# EasyEDA Pro project easyeda项目.epro

# Schematic Schematic1

## Sheets
1 Power: Create Date: 2026-03-11; Page Name: P1; Project Name: HomeNode; Schematic Name: Schematic1; Update Date: 2026-03-11; Company: 嘉立创EDA; Page Size: A4; Version: V1.0
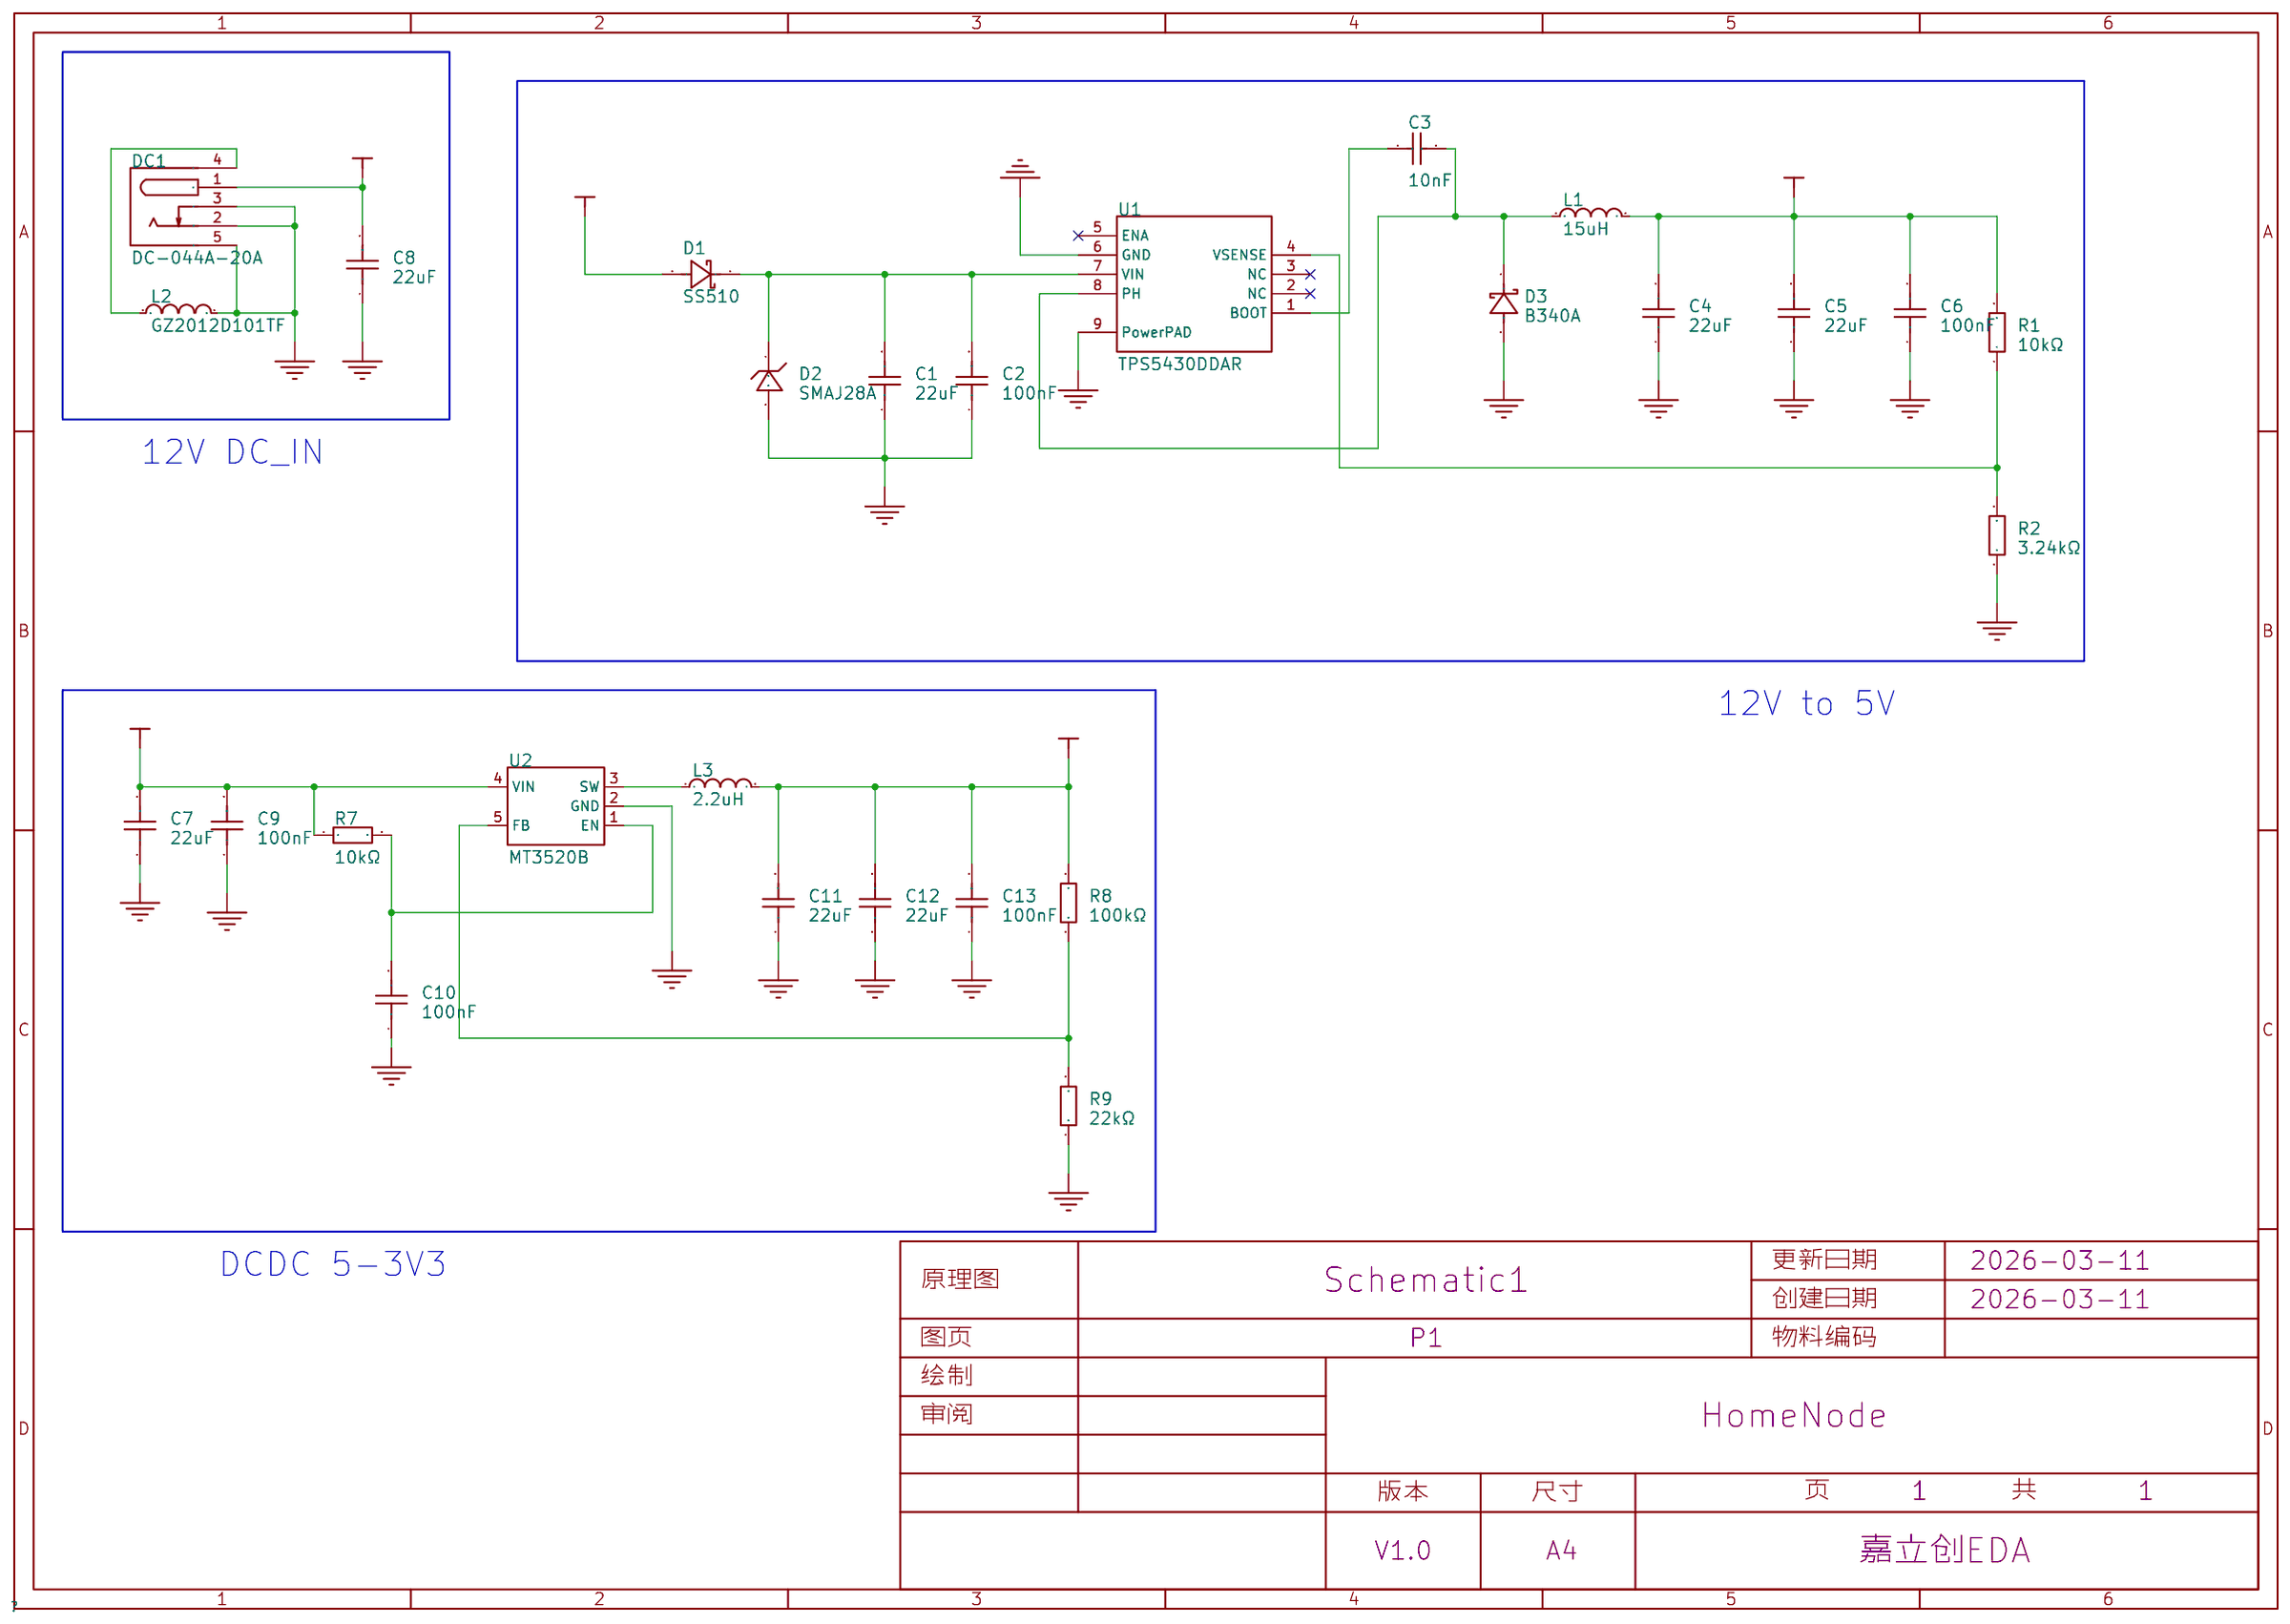
[diagram p0: Power]
2 Peripheral: Page Name: Peripheral
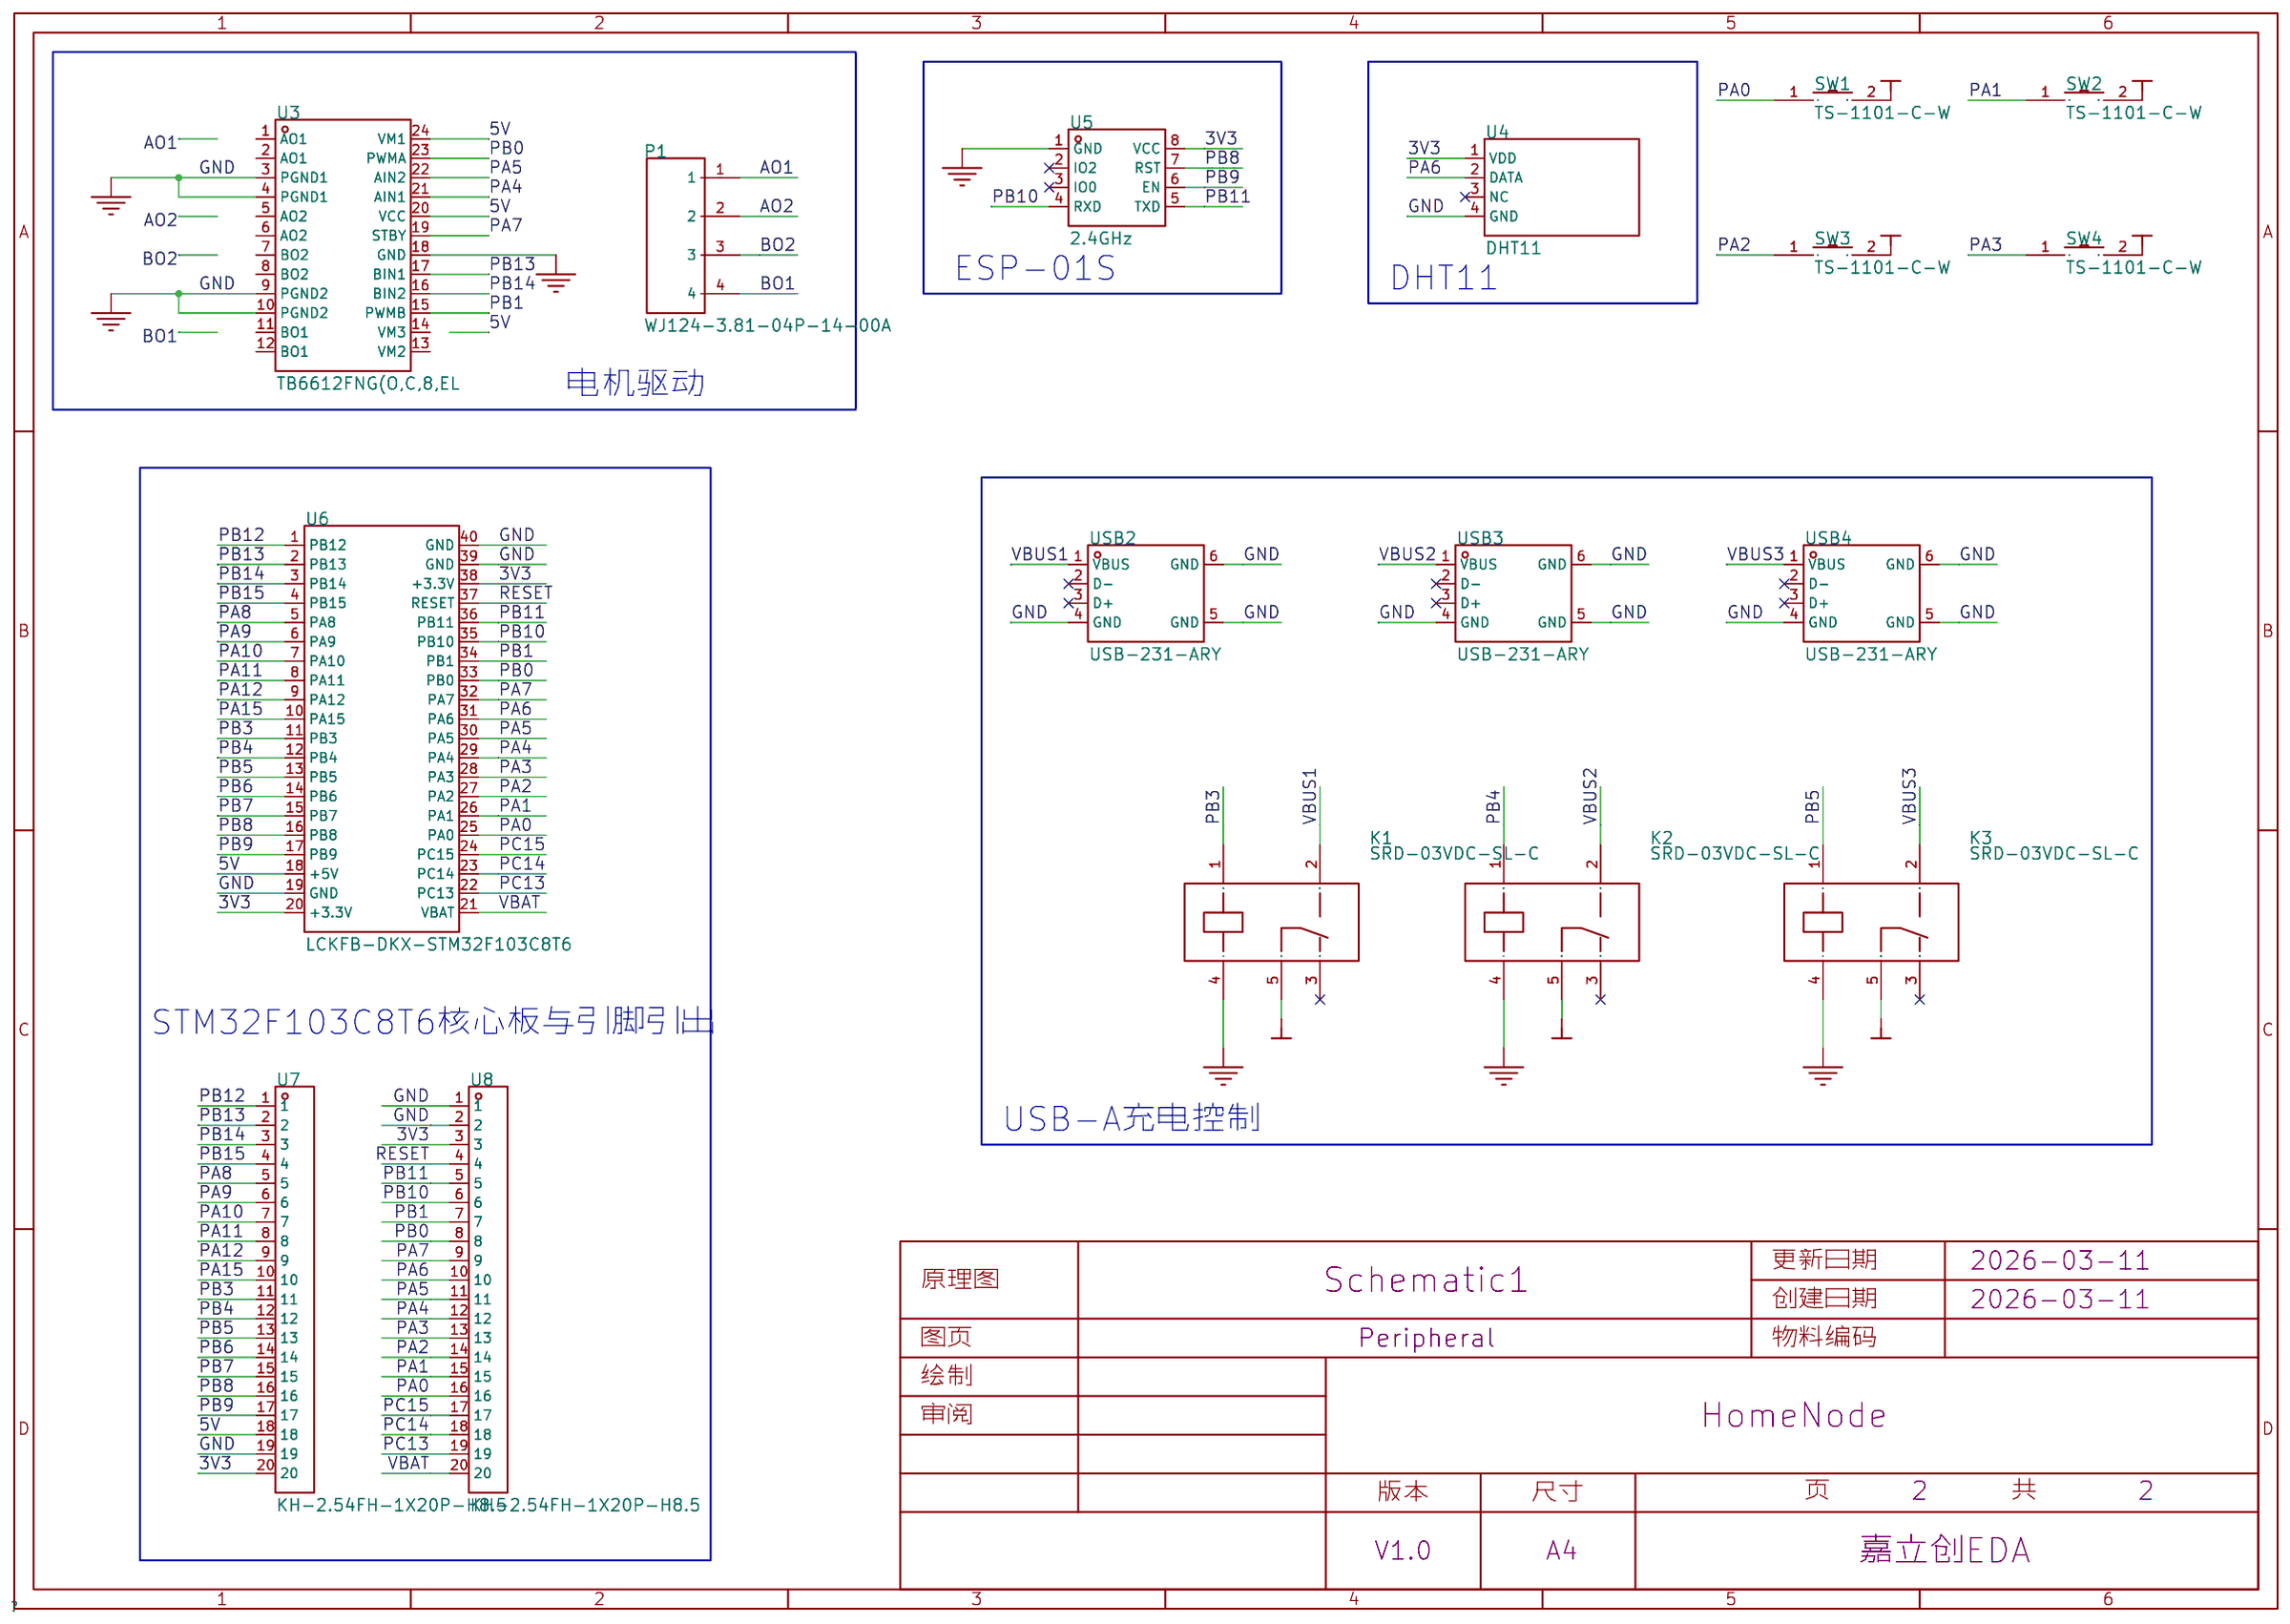
[diagram p1: Peripheral]

## Parts
sheet Peripheral
K1  SRD-03VDC-SL-C  [RELAY-TH_SRD-XXVDC-XL-C]
K2  SRD-03VDC-SL-C  [RELAY-TH_SRD-XXVDC-XL-C]
K3  SRD-03VDC-SL-C  [RELAY-TH_SRD-XXVDC-XL-C]
P1  WJ124-3.81-04P-14-00A  [CONN-TH_4P-P3.81_KF124-3.81-4P]
SW1  TS-1101-C-W  [SW-SMD_L6.0-W3.3-LS8.0]
SW2  TS-1101-C-W  [SW-SMD_L6.0-W3.3-LS8.0]
SW3  TS-1101-C-W  [SW-SMD_L6.0-W3.3-LS8.0]
SW4  TS-1101-C-W  [SW-SMD_L6.0-W3.3-LS8.0]
U3  TB6612FNG(O,C,8,EL  [SSOP-24_L8.4-W5.8-P0.65-LS7.8-BL]
U4  DHT11  [SENSOR-TH_DHT11]
U5  2.4GHz  [WIFIM-TH_8P-L24.7-W14.4-P2.54]
U6  LCKFB-DKX-STM32F103C8T6  [CONN-TH_L53.3-W22.9_STM32F103C8T6-CARD]
U7  KH-2.54FH-1X20P-H8.5  [HDR-TH_20P-P2.54-V-F-2]
U8  KH-2.54FH-1X20P-H8.5  [HDR-TH_20P-P2.54-V-F-2]
USB2  USB-231-ARY  [USB-A-TH_USB-231-ARY]
USB3  USB-231-ARY  [USB-A-TH_USB-231-ARY]
USB4  USB-231-ARY  [USB-A-TH_USB-231-ARY]
sheet Power
C1  22uF  [C0603]
C2  100nF  [C0603]
C3  10nF  [C0603]
C4  22uF  [C0603]
C5  22uF  [C0603]
C6  100nF  [C0603]
C7  22uF  [C0603]
C8  22uF  [C0603]
C9  100nF  [C0603]
C10  100nF  [C0603]
C11  22uF  [C0603]
C12  22uF  [C0603]
C13  100nF  [C0603]
D1  SS510  [SMA_L4.3-W2.6-LS5.0-RD]
D2  SMAJ28A  [SMA_L4.4-W2.8-LS5.4-RD]
D3  B340A  [SMA_L4.3-W2.6-LS5.0-RD]
DC1  DC-044A-20A  [DC-IN-TH_DC-044A-20A]
L1  15uH  [IND-SMD_L7.5-W6.6]
L2  GZ2012D101TF  [L0805]
L3  2.2uH  [IND-SMD_L4.6-W4.1_MHCI04015]
R1  10kΩ  [R0603]
R2  3.24kΩ  [R0603]
R7  10kΩ  [R0603]
R8  100kΩ  [R0603]
R9  22kΩ  [R0603]
U1  TPS5430DDAR  [ESOP-8_L4.9-W3.9-P1.27-LS6.0-TL-EP]
U2  MT3520B  [SOT-23-5_L3.0-W1.7-P0.95-LS2.8-BR]

## Library data of the parts
K1-K3 = SRD-03VDC-SL-C: 线圈电压:3V;触点形式:一组转换:1C(单刀双掷-转换);触点容量(电阻负载):-;最大切换电压:250V@AC;最大切换电流:15A;; LCSC Part Name: 蓝色 单组转换型继电器; Supplier Part: C24585; Manufacturer: 松乐; Supplier Footprint: 插件,19.2x15.6mm; JLCPCB Part Class: Extended Part; Datasheet: https://item.szlcsc.com/datasheet/SRD-03VDC-SL-C/25325.html; Supplier: LCSC; Coil Voltage: 3V; Contact Form: 一组转换:1C(单刀双掷-转换); Number of Pins: 5; Switching Voltage(Max): 250V@AC; Coil Rated Power: 360mW; Switching Current(Max): 15A; Coil Type: 无极性-单线圈; Contact Resistance: 100mΩ; Operate Time: 10ms; Release Time: 10ms
P1 = WJ124-3.81-04P-14-00A: 结构:1x4P;间距:3.81mm;颜色:绿色;安装方式:直插;排数:1;每排PIN数:4;额定电流:15A;额定电压:300V;线规 - AWG:14~30;线规 - 平方毫米:1.5;工作温度:-40℃~+105℃;; LCSC Part Name: 3.81mm 1x4P 排数:1 每排P数:4 直插; Supplier Part: C69809; Manufacturer: KANGNEX(康奈克斯电气); Supplier Footprint: 插件,P=3.81mm; JLCPCB Part Class: Extended Part; Datasheet: https://item.szlcsc.com/datasheet/WJ124-3.81-04P-14-00A/70903.html; Supplier: LCSC; Number of Positions or Pins: 1x4P; Pitch: 3.81mm; Color: 绿色; Mounting Type: 直插; Number of Pins: 4P; Number of Rows: 1; Number of PINs Per Row: 4; Current Rating: 15A; Voltage Rating (Max): 300V; Wire Gauge - AWG: 14~30; Wire Gauge - mm2: 1.5; Operating Temperature: -40℃~+105℃
SW1-SW4 = TS-1101-C-W: 电路结构:单刀单掷;按钮形状:矩形按钮;作用力:260gf;安装方式:立贴;开关长度:6mm;开关宽度:3.6mm;开关高度:2.5mm;带支架:不带;触点电流:50mA;额定电压(AC):-;额定电压(DC):12V;额定功率:-;绝缘电阻:-;带灯:无;机械寿命:5万次;; LCSC Part Name: 6*3.6*2.5mm 立贴 轻触开关; Supplier Part: C318938; Manufacturer: XKB Connectivity(中国星坤); Supplier Footprint: SMD; JLCPCB Part Class: Extended Part; Datasheet: https://atta.szlcsc.com/upload/public/pdf/source/20200227/C318938_C2E53B1EEDE37D980A33616AC086DE53.pdf; Supplier: LCSC; Circuit: 单刀单掷; Actuator Style: 矩形按钮; Operating Force: 260gf; Mounting Style: 立贴; Switch Length: 6mm; Switch Width: 3.6mm; Switch Height: 2.5mm; Strike Gundam: 不带; Contact Current: 50mA; Voltage Rating (DC): 12V; Actuator/Cap Color: 白色带淡绿; With Lamp: 无; Mechanical Life: 5万次; Operating Temperature: -30℃~+85℃
U3 = TB6612FNG(O,C,8,EL: 双直流电机驱动器集成电路; LCSC Part Name: 双直流电机驱动IC; Supplier Part: C88224; Manufacturer: TOSHIBA(东芝); Supplier Footprint: SSOP-24-208mil; JLCPCB Part Class: Extended Part; Datasheet: https://item.szlcsc.com/datasheet/TB6612FNG(O%252CC%252C8%252CEL/89402.html; Supplier: LCSC; Technology: 是; Number of H-bridges: 2; Output Current: 1A; Peak Current: 3.2A; Voltage - Supply: 2.7V~5.5V; RDS(on): 500mΩ; Quiescent Current(Iq): 1uA; Operating Temperature: -20℃~+85℃
U4 = DHT11: 温度范围:-20℃~+60℃;湿度范围:5%RH~95%RH;湿度精度:±5%RH;; LCSC Part Name: 新款电容式数字温湿度传感器,老款已停产16.1x12.6x5.8mm DHT11  电容式传感器; Supplier Part: C117051; Manufacturer: 广州奥松; Supplier Footprint: SIP-4; JLCPCB Part Class: Extended Part; Datasheet: https://item.szlcsc.com/datasheet/DHT11/118309.html; Supplier: LCSC; Temperature Range: -20℃~+60℃; Humidity: 5%RH~95%RH; Voltage - Supply: 3.3V~5.5V; Current - Supply: 1mA; Humidity Tolerance: ±5%RH; Temperature Tolerance: ±2℃
U5 = ESP-01S: 核心处理器:ESP8266芯片;频率:2.4GHz;天线形式:板载PCB天线;发射功率:16dBm;接收灵敏度:-90dBm;; LCSC Part Name: 完整的802.11b/g/nWi-FiSoC模块; Supplier Part: C503582; Manufacturer: Ai-Thinker(安信可); JLCPCB Part Class: Extended Part; Datasheet: https://atta.szlcsc.com/upload/public/pdf/source/20200407/C503582_1139AF8FB42E05635FA0089E1752A536.pdf; Supplier: LCSC; Core Processor: ESP8266芯片; Support Interface: GPIO；UART；PWM; Antenna Type: 板载PCB天线; Output Power: 16dBm; Operating Voltage: 3V~3.6V; Receive  Current: 56mA; Send  Current: 170mA; Sensitivity: -90dBm; Operating Temperature: -20℃~+70℃
U6 = LCKFB-DKX-STM32F103C8T6: 搭载Contex M3内核,程序存储容量64KB,RAM总容量20KB,最高72MHz主频,提供高效的计算能力和稳定的运行环境。; LCSC Part Name: 立创·地阔星-STM32F103C8T6开发板; Supplier Part: C22396880; Manufacturer: 立创开发板; JLCPCB Part Class: Extended Part; Datasheet: https://item.szlcsc.com/datasheet/LCKFB-DKX-STM32F103C8T6/24005615.html; Supplier: LCSC
U7 U8 = KH-2.54FH-1X20P-H8.5: 插孔结构:1x20P;间距:2.54mm;行距:-;圆孔/方孔:方孔;安装方式:直插;排数:单排;总孔位数:20P;额定电流:3A;额定电压:-;插孔方向:顶部;塑高:8.5mm;工作温度:-40℃~+105℃;; LCSC Part Name: 间距:2.54mm 1x20P 直插; Supplier Part: C2905423; Manufacturer: kinghelm(金航标); Supplier Footprint: 插件,P=2.54mm; JLCPCB Part Class: Extended Part; Datasheet: https://item.szlcsc.com/datasheet/KH-2.54FH-1X20P-H8.5/3175197.html; Supplier: LCSC; Holes Structure: 1x20P; Pitch: 2.54mm; Circular Hole / Square Hole: 方孔; Mounting Type: 直插; Number of Rows: 单排; Number of Positions: 20P; Current Rating: 3A; Holes Direction: 顶部; Insulation Height: 8.5mm; Operating Temperature: -40℃~+105℃
USB2-USB4 = USB-231-ARY: 连接器类型:Type-A;协议标准:USB 2.0;公母:母;安装方式:弯插;触点数量:4P;端口数量:1;额定电流 - 电源:1.5A;工作温度:-20℃~+70℃;; LCSC Part Name: Type-A 母 弯插; Supplier Part: C720525; Manufacturer: XUNPU(讯普); Supplier Footprint: 弯插; JLCPCB Part Class: Extended Part; Datasheet: https://item.szlcsc.com/datasheet/USB-231-ARY/763532.html; Supplier: LCSC; Connector Type: Type-A; Protocol Standard: USB 2.0; Gender: 母; Mounting Type: 弯插; Number of Contacts: 4P; Number of Ports: 1; Current Rating-Power: 1.5A; Voltage Rating: 30V; Length: 14.2mm; Detection color: 白色; Operating Temperature: -20℃~+70℃
C1 C4 C5 C7 C8 C11 C12 = CGA0603X5R226M100JT: 容值:22uF;精度:±20%;额定电压:10V;温度系数:X5R;; LCSC Part Name: 22uF ±20% 10V; Supplier Part: C6119863; Manufacturer: HRE(芯声); Supplier Footprint: 0603; JLCPCB Part Class: Extended Part; Datasheet: https://item.szlcsc.com/datasheet/CGA0603X5R226M100JT/7062569.html; Supplier: LCSC; Tolerance: ±20%; Voltage Rating: 10V; Temperature Coefficient: X5R
C2 C6 C9 C10 C13 = CGA0603X7R104K500JT: 容值:100nF;精度:±10%;额定电压:50V;温度系数:X7R;; LCSC Part Name: 100nF ±10% 50V; Supplier Part: C6119867; Manufacturer: HRE(芯声); Supplier Footprint: 0603; JLCPCB Part Class: Extended Part; Datasheet: https://item.szlcsc.com/datasheet/CGA0603X7R104K500JT/7062573.html; Supplier: LCSC; Tolerance: ±10%; Voltage Rating: 50V; Temperature Coefficient: X7R
C3 = CC0603KRX7R9BB103: 容值:10nF;精度:±10%;额定电压:50V;温度系数:X7R;; LCSC Part Name: 10nF ±10% 50V; Supplier Part: C100042; Manufacturer: YAGEO(国巨); Supplier Footprint: 0603; JLCPCB Part Class: Extended Part; Datasheet: https://item.szlcsc.com/datasheet/CC0603KRX7R9BB103/101256.html; Supplier: LCSC; Tolerance: ±10%; Voltage Rating: 50V; Temperature Coefficient: X7R
D1 = SS510_C18199171: 二极管配置:独立式;正向压降(Vf):850mV@5A;直流反向耐压(Vr):100V;整流电流:5A;; LCSC Part Name: 电压:100V 电流:5A; Supplier Part: C18199171; Manufacturer: R+O(宏嘉诚); Supplier Footprint: SMA(DO-214AC); JLCPCB Part Class: Extended Part; Datasheet: https://item.szlcsc.com/datasheet/SS510/19354403.html; Supplier: LCSC; Diode Configuration: 独立式; Voltage - Forward(Vf@If): 850mV@5A; Voltage - DC Reverse(Vr): 100V; Current - Rectified: 5A; Reverse Leakage Current (Ir): 50uA@100V; Operating Junction Temperature Range: -55℃~+150℃; Non-Repetitive Peak Forward Surge Current: 120A
D2 = SMAJ28A_C148227: 极性:单向;反向截止电压(Vrwm):28V;钳位电压:45.4V;峰值脉冲电流(Ipp):8.8A@10/1000us;峰值脉冲功率(Ppp):400W@10/1000us;击穿电压:34.4V;; Supplier Part: C148227; Manufacturer: Littelfuse(美国力特); Supplier Footprint: SMA(DO-214AC); JLCPCB Part Class: Extended Part; Datasheet: https://item.szlcsc.com/datasheet/SMAJ28A/159560.html; Supplier: LCSC; Polarity: 单向; Reverse Stand-Off Voltage (Vrwm): 28V; Clamping Voltage: 45.4V; Peak Pulse Current (Ipp): 8.8A@10/1000us; Peak Pulse Power Dissipation (Ppp): 400W@10/1000us; Voltage - Breakdown: 34.4V; Reverse Leakage Current (Ir): 1uA; Operating Temperature: -65℃~+150℃; level of protection: IEC 61000-4-4；IEC 61000-4-2; Type: TVS
D3 = B340A_C48642440: 二极管配置:1个独立式;正向压降(Vf):550mV@3A;直流反向耐压(Vr):40V;整流电流:3A;; LCSC Part Name: 电压:40V 电流:3A; Supplier Part: C48642440; Manufacturer: R+O(宏嘉诚); Supplier Footprint: SMA; JLCPCB Part Class: Extended Part; Datasheet: https://item.szlcsc.com/datasheet/B340A/50921404.html; Supplier: LCSC; Diode Configuration: 1个独立式; Voltage - Forward(Vf@If): 550mV@3A; Voltage - DC Reverse(Vr): 40V; Current - Rectified: 3A; Reverse Leakage Current (Ir): 50uA@40V; Operating Junction Temperature Range: -55℃~+150℃; Non-Repetitive Peak Forward Surge Current: 100A
DC1 = DC-044A-20A: 连接器类型:DC电源插座;安装方式:弯插;触点内径:2mm;触点外径:5.9mm;额定电流:5A;额定电压:30V;工作温度:-20℃~+70℃;; LCSC Part Name: DC电源插座 内径:2mm 外径:5.9mm; Supplier Part: C129006; Manufacturer: 韩国韩荣; Supplier Footprint: 插件; JLCPCB Part Class: Extended Part; Datasheet: https://item.szlcsc.com/datasheet/DC-044A-20A/140292.html; Supplier: LCSC; Connector Type: DC电源插座; Mounting Type: 弯插; Inside Contact Diameter: 2mm; Outside Contact Diameter: 5.9mm; Current Rating: 5A; Voltage Rating (Max): 30V; Operating Temperature: -20℃~+70℃
L1 = PCR0650-150-M: 电感值:15uH;精度:±20%;额定电流:4A;饱和电流(Isat):5A;类型:一体成型电感;; LCSC Part Name: 15μH ±20% 5A; Supplier Part: C53896883; Manufacturer: JIERR(捷而瑞); Supplier Footprint: SMD,7.5x6.6mm; JLCPCB Part Class: Extended Part; Datasheet: https://item.szlcsc.com/datasheet/PCR0650-150-M/57092565.html; Supplier: LCSC; Tolerance: ±20%; Current Rating: 4A; Current - Saturation(Isat): 5A; DC Resistance(DCR): 90mΩ; Type: 一体成型电感
L2 = GZ2012D101TF: 阻抗@频率:100Ω@100MHz;误差:±25%;直流电阻(DCR):150mΩ;; LCSC Part Name: 单路 0805磁珠 阻抗100Ω@100MHz; Supplier Part: C1015; Manufacturer: Sunlord(顺络); Supplier Footprint: 0805; JLCPCB Part Class: Basic Part; Datasheet: https://item.szlcsc.com/datasheet/GZ2012D101TF/1367.html; Supplier: LCSC; Impedance @ Frequency: 100Ω@100MHz; Tolerance: ±25%; DC Resistance(DCR): 150mΩ; Current Rating: 800mA; Number of Circuits: 1; Operating Temperature: -55℃~+125℃
L3 = SRG0420-2R2-M: 电感值:2.2uH;精度:±20%;额定电流:4A;饱和电流(Isat):5A;类型:一体成型电感;; LCSC Part Name: 2.2μH ±20% 5A; Supplier Part: C53462916; Manufacturer: JIERR(捷而瑞); Supplier Footprint: SMD,4.6x4.1mm; JLCPCB Part Class: Extended Part; Datasheet: https://item.szlcsc.com/datasheet/SRG0420-2R2-M/56628161.html; Supplier: LCSC; Tolerance: ±20%; Current Rating: 4A; Current - Saturation(Isat): 5A; DC Resistance(DCR): 49mΩ; Type: 一体成型电感
R1 R7 = 0603WAF1002T5E: 电阻类型:厚膜电阻;阻值:10kΩ;精度:±1%;功率:100mW;工作电压:75V;温度系数:±100ppm/℃;; LCSC Part Name: 厚膜电阻 10kΩ ±1% 100mW; Supplier Part: C25804; Manufacturer: UNI-ROYAL(厚声); Supplier Footprint: 0603; JLCPCB Part Class: Basic Part; Datasheet: https://item.szlcsc.com/datasheet/0603WAF1002T5E/26547.html; Supplier: LCSC; Type: 厚膜电阻; Tolerance: ±1%; Power(Watts): 100mW; Voltage-Supply(Max): 75V; Temperature Coefficient: ±100ppm/℃; Operating Temperature: -55℃~+155℃
R2 = RMC06033.24K1%N: 电阻类型:厚膜电阻;阻值:3.24kΩ;精度:±1%;功率:100mW;工作电压:50V;温度系数:±100ppm/℃;; LCSC Part Name: 3.24kΩ ±1% 100mW; Supplier Part: C269709; Manufacturer: Tyohm(幸亚电阻); Supplier Footprint: 0603; JLCPCB Part Class: Extended Part; Datasheet: https://item.szlcsc.com/datasheet/RMC06033.24K1%2525N/259149.html; Supplier: LCSC; Type: 厚膜电阻; Tolerance: ±1%; Power(Watts): 100mW; Voltage-Supply(Max): 50V; Temperature Coefficient: ±100ppm/℃; Operating Temperature: -55℃~+155℃
R8 = 0603WAF1003T5E: 电阻类型:厚膜电阻;阻值:100kΩ;精度:±1%;功率:100mW;工作电压:75V;温度系数:±100ppm/℃;; LCSC Part Name: 100kΩ ±1% 100mW 厚膜电阻; Supplier Part: C25803; Manufacturer: UNI-ROYAL(厚声); Supplier Footprint: 0603; JLCPCB Part Class: Basic Part; Datasheet: https://item.szlcsc.com/datasheet/0603WAF1003T5E/26546.html; Supplier: LCSC; Type: 厚膜电阻; Tolerance: ±1%; Power(Watts): 100mW; Temperature Coefficient: ±100ppm/℃; Overload Voltage (Max): 75V; Operating Temperature Range: -55℃~+155℃; Voltage-Supply(Max): 75V; Operating Temperature: -55℃~+155℃
R9 = 0603WAF2202T5E: 电阻类型:厚膜电阻;阻值:22kΩ;精度:±1%;功率:100mW;工作电压:75V;温度系数:±100ppm/℃;; LCSC Part Name: 22kΩ ±1% 100mW 厚膜电阻; Supplier Part: C31850; Manufacturer: UNI-ROYAL(厚声); Supplier Footprint: 0603; JLCPCB Part Class: Basic Part; Datasheet: https://item.szlcsc.com/datasheet/0603WAF2202T5E/32812.html; Supplier: LCSC; Type: 厚膜电阻; Tolerance: ±1%; Power(Watts): 100mW; Voltage-Supply(Max): 75V; Temperature Coefficient: ±100ppm/℃; Operating Temperature: -55℃~+155℃
U1 = TPS5430DDAR: 功能类型:降压型;工作电压:5.5V~36V;输出电压:1.221V~32.04V;输出电流:3A;输出类型:可调;; LCSC Part Name: 降压型 3A 5.5V~36V; Supplier Part: C9864; Manufacturer: TI(德州仪器); Supplier Footprint: SOIC-8-EP; JLCPCB Part Class: Basic Part; Datasheet: https://www.ti.com/lit/ds/symlink/tps5430.pdf; Supplier: LCSC; Function: 降压型; Voltage - Supply: 5.5V~36V; Output Voltage: 1.221V~32.04V; Output Current: 3A; Frequency - Switching: 500kHz; Operating Temperature: -40℃~+125℃@(TJ); Synchronous Rectifier: 否; Number of Outputs: 1; Topology: 降压式; Quiescent Current: 4.4mA; Switch tube (built-in/external): 内置; Output Type: 可调
U2 = MT3520B: 功能类型:降压型;工作电压:2.3V~6V;输出电流:2A;输出类型:可调;; LCSC Part Name: 停产 降压型 2A 2.3V~6V; Supplier Part: C2684933; Manufacturer: 西安航天民芯; Supplier Footprint: SOT-23-5; JLCPCB Part Class: Extended Part; Datasheet: https://item.szlcsc.com/datasheet/MT3520B/2783998.html; Supplier: LCSC; Function: 降压型; Voltage - Supply: 2.3V~6V; Output Current: 2A; Frequency - Switching: 1.5MHz; Operating Temperature: -40℃~+85℃; Synchronous Rectifier: 是; Number of Outputs: 1; Topology: 降压式; Quiescent Current: 40uA; Switch tube (built-in/external): 内置; Output Type: 可调

## Nets
3V3: C11.2 C12.2 C13.2 L3.2 R8.2 SW1.2 SW2.2 SW3.2 SW4.2 U4.1(VDD) U5.8(VCC) U6.20(+3.3V) U6.38(+3.3V) U7.20 U8.3
5V: C4.2 C5.2 C6.2 C7.2 C9.2 K1.5 K2.5 K3.5 L1.2 R1.2 R7.1 U2.4(VIN) U3.13(VM2) U3.14(VM3) U3.20(VCC) U3.24(VM1) U6.18(+5V) U7.18
12V: C8.2 D1.2(A) DC1.1
GND: C1.1 C2.1 C4.1 C5.1 C6.1 C7.1 C8.1 C9.1 C10.1 C11.1 C12.1 C13.1 D2.2 D3.2(A) DC1.2 DC1.3 DC1.5 K1.4 K2.4 K3.4 L2.2 R2.1 R9.1 U1.6(GND) U1.9(PowerPAD) U2.2(GND) U3.3(PGND1) U3.4(PGND1) U3.9(PGND2) U3.10(PGND2) U3.18(GND) U4.4(GND) U5.1(GND) U6.19(GND) U6.39(GND) U6.40(GND) U7.19 U8.1 U8.2 USB2.4(GND) USB2.5(GND) USB2.6(GND) USB3.4(GND) USB3.5(GND) USB3.6(GND) USB4.4(GND) USB4.5(GND) USB4.6(GND)
VBAT: U6.21(VBAT) U8.20
VBUS1: K1.2 USB2.1(VBUS)
VBUS2: K2.2 USB3.1(VBUS)
VBUS3: K3.2 USB4.1(VBUS)
AO1: P1.1 U3.1(AO1) U3.2(AO1)
AO2: P1.2 U3.5(AO2) U3.6(AO2)
BO1: P1.4 U3.11(BO1) U3.12(BO1)
BO2: P1.3 U3.7(BO2) U3.8(BO2)
PA0: SW1.1 U6.25(PA0) U8.16
PA1: SW2.1 U6.26(PA1) U8.15
PA2: SW3.1 U6.27(PA2) U8.14
PA3: SW4.1 U6.28(PA3) U8.13
PA4: U3.21(AIN1) U6.29(PA4) U8.12
PA5: U3.22(AIN2) U6.30(PA5) U8.11
PA6: U4.2(DATA) U6.31(PA6) U8.10
PA7: U3.19(STBY) U6.32(PA7) U8.9
PA8: U6.5(PA8) U7.5
PA9: U6.6(PA9) U7.6
PA10: U6.7(PA10) U7.7
PA11: U6.8(PA11) U7.8
PA12: U6.9(PA12) U7.9
PA15: U6.10(PA15) U7.10
PB0: U3.23(PWMA) U6.33(PB0) U8.8
PB1: U3.15(PWMB) U6.34(PB1) U8.7
PB3: K1.1 U6.11(PB3) U7.11
PB4: K2.1 U6.12(PB4) U7.12
PB5: K3.1 U6.13(PB5) U7.13
PB6: U6.14(PB6) U7.14
PB7: U6.15(PB7) U7.15
PB8: U5.7(RST) U6.16(PB8) U7.16
PB9: U5.6(EN) U6.17(PB9) U7.17
PB10: U5.4(RXD) U6.35(PB10) U8.6
PB11: U5.5(TXD) U6.36(PB11) U8.5
PB12: U6.1(PB12) U7.1
PB13: U3.17(BIN1) U6.2(PB13) U7.2
PB14: U3.16(BIN2) U6.3(PB14) U7.3
PB15: U6.4(PB15) U7.4
PC13: U6.22(PC13) U8.19
PC14: U6.23(PC14) U8.18
PC15: U6.24(PC15) U8.17
RESET: U6.37(RESET) U8.4
$1N32: DC1.4 L2.1
$1N65: C10.2 R7.2 U2.1(EN)
$1N68: L3.1 U2.3(SW)
$1N73: R8.1 R9.2 U2.5(FB)
$1N77: C1.2 C2.2 D1.1(K) D2.1 U1.7(VIN)
$1N81: C3.1 D3.1(K) L1.1 U1.8(PH)
$1N82: C3.2 U1.1(BOOT)
$1N88: R1.1 R2.2 U1.4(VSENSE)

Not connected (* = marked no-connect by the designer): K1 3*; K2 3*; K3 3*; U1 2(NC)* 3(NC)* 5(ENA)*; U4 3(NC)*; U5 2(IO2)* 3(IO0)*; USB2 2(D-)* 3(D+)*; USB3 2(D-)* 3(D+)*; USB4 2(D-)* 3(D+)*

## Notes on the sheets
sheet 1
- 12V DC_IN
- 12V to 5V
- DCDC 5-3V3
sheet 2
- ESP-01S
- DHT11
- 电机驱动
- STM32F103C8T6核心板与引脚引出
- USB-A充电控制

# Board NodePCB
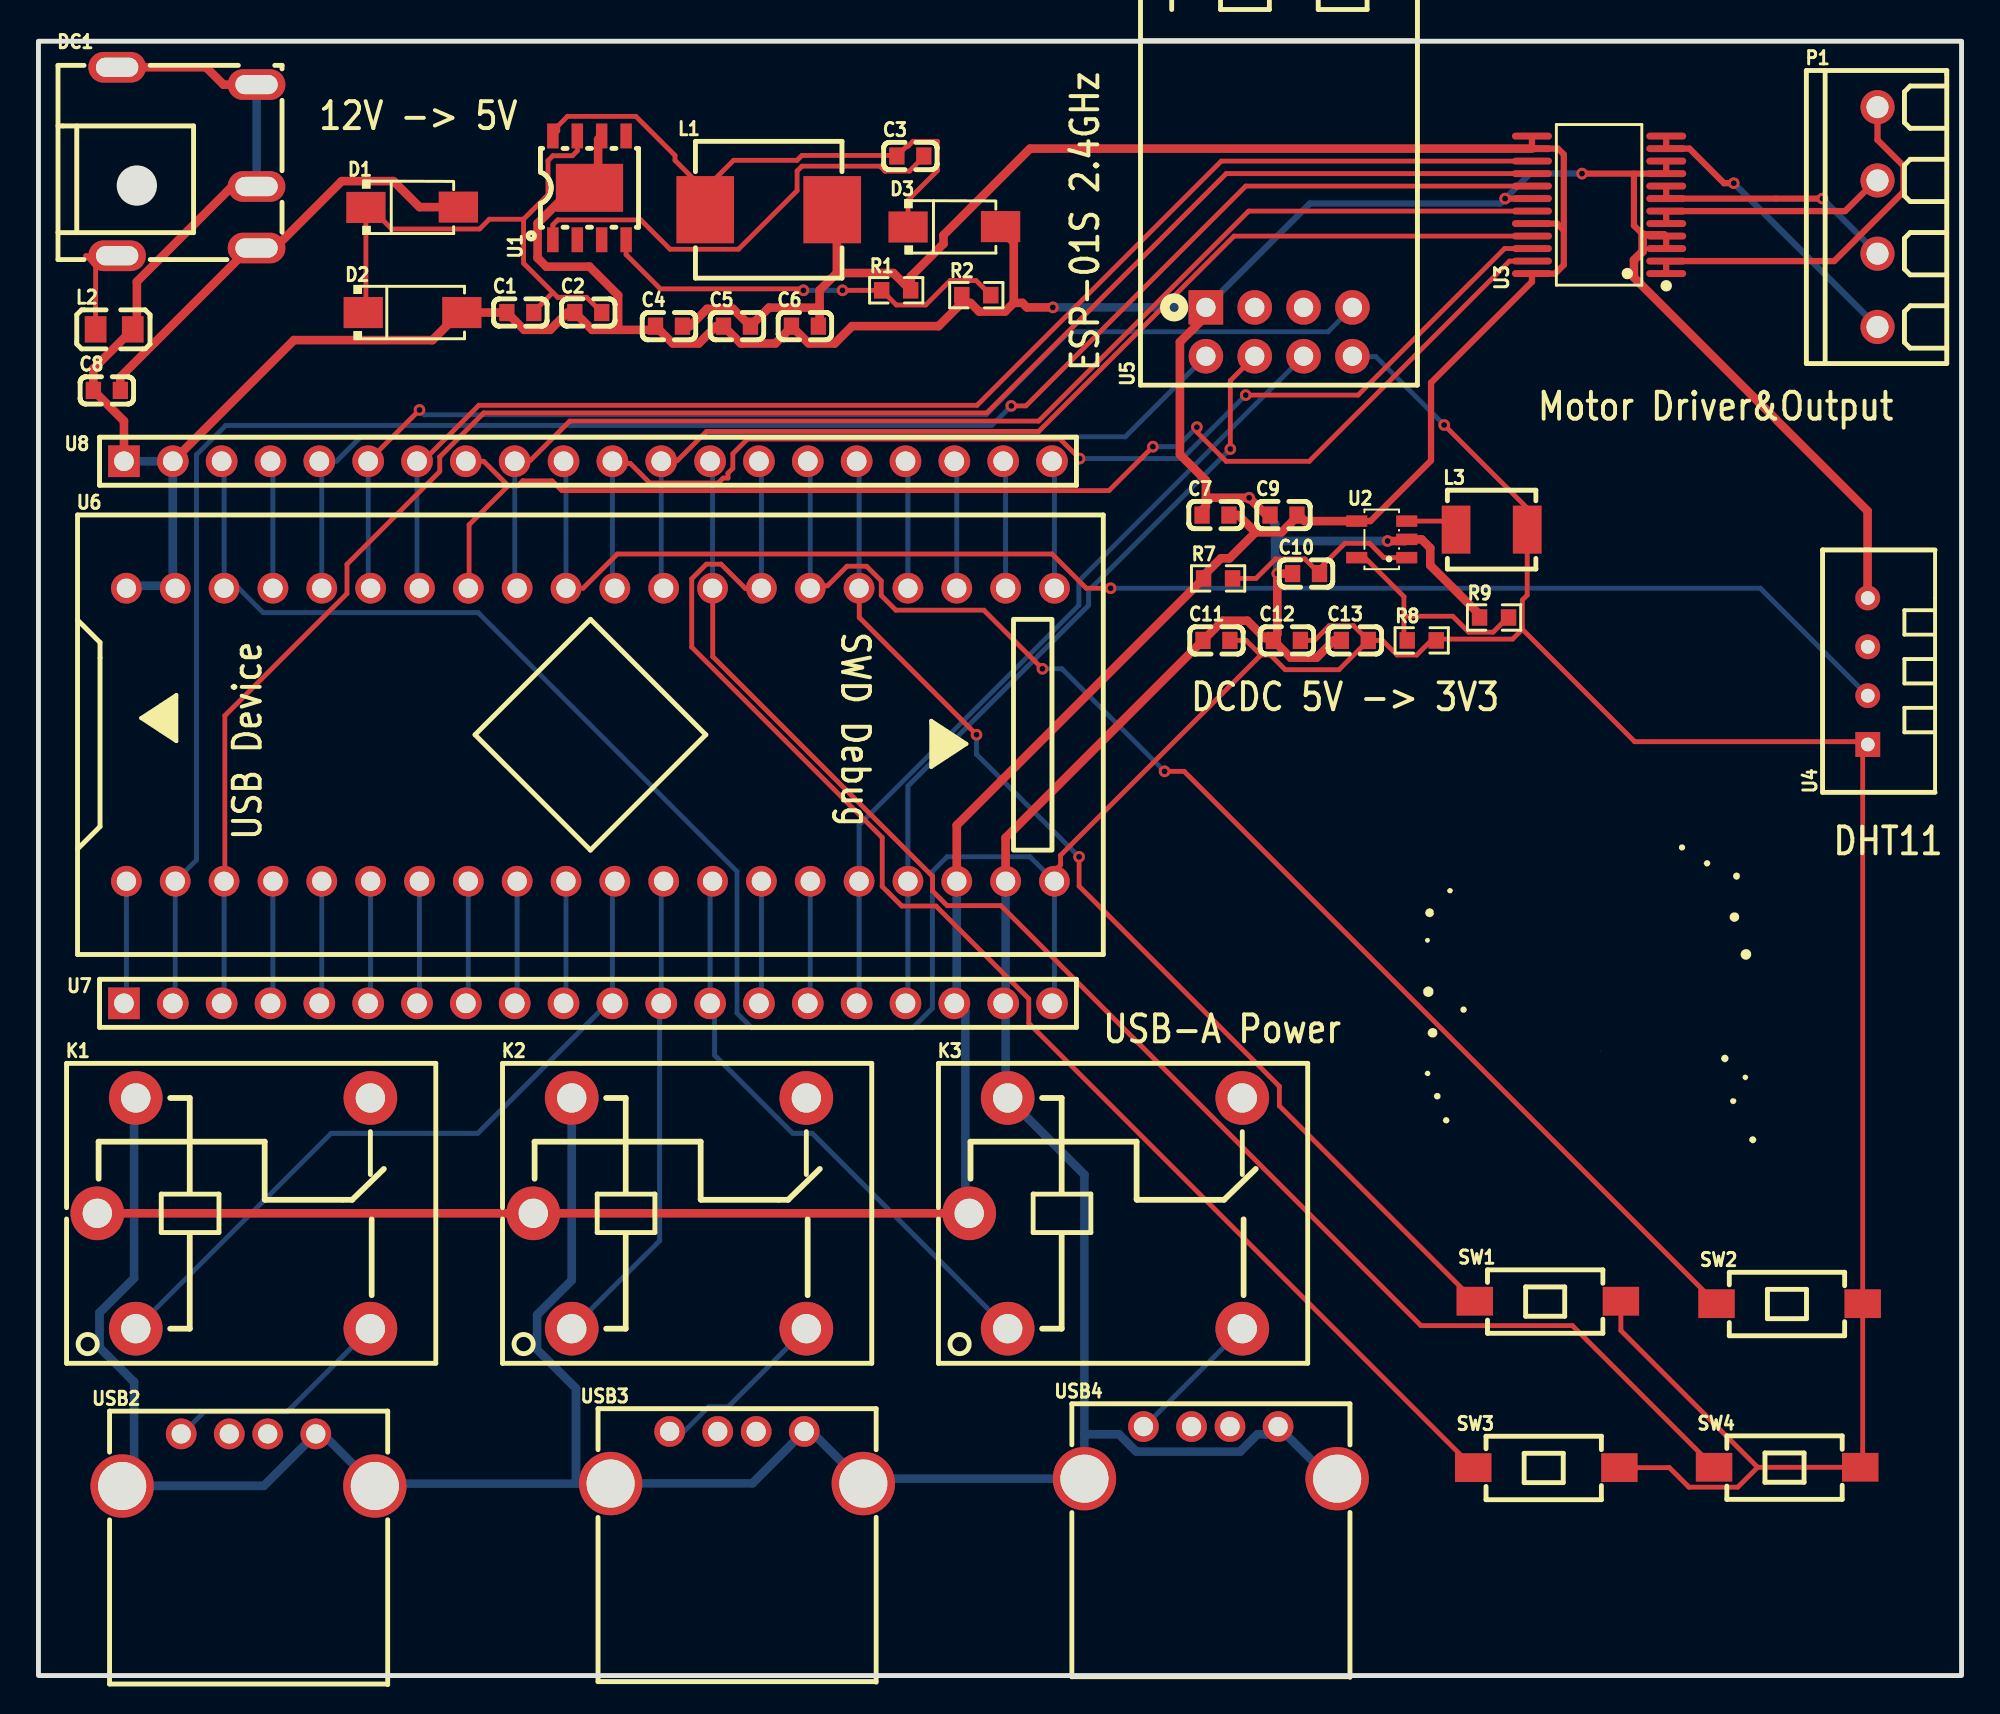
[diagram p2: board, top side]
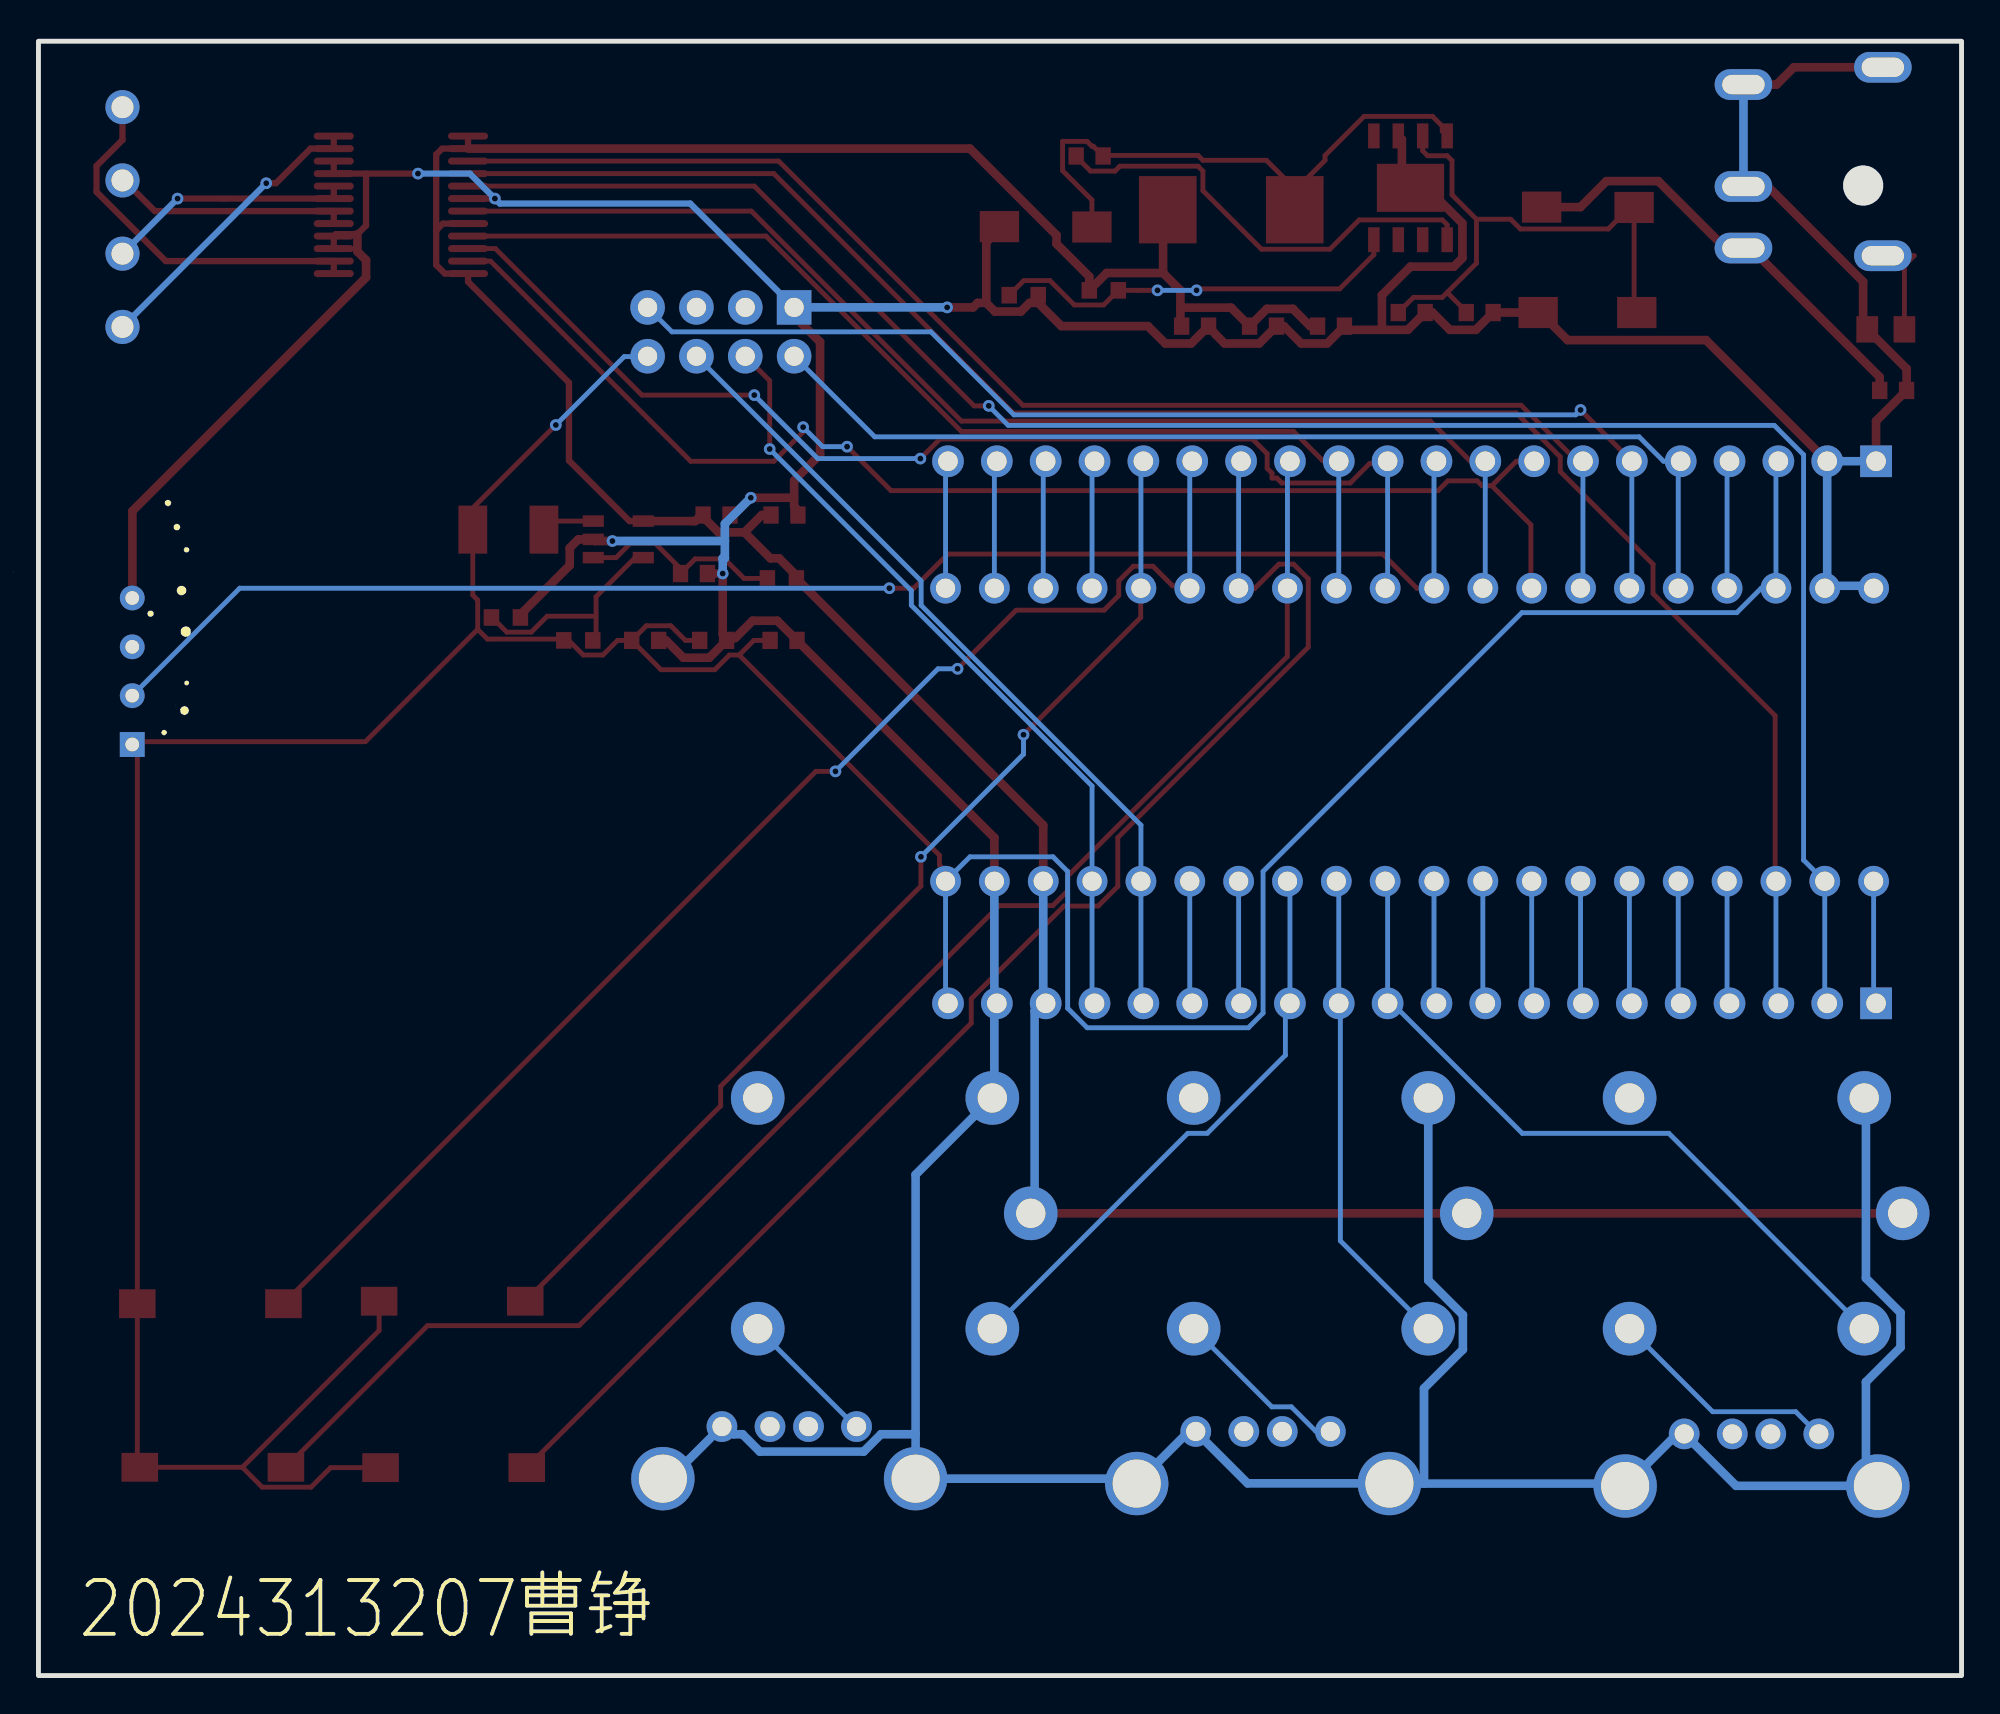
[diagram p3: board, bottom side, seen from below]

Outline 100 x 85 mm; copper layers: Top Layer, Bottom Layer. Coordinates in mm from the lower left corner of the outline.
Outline path: rectangle 0,85 100,0
Stack: Top Layer 0.035mm / Dielectric1 1.51mm FR4 er 4.5 / Bottom Layer 0.035mm

## Design rules (mm)
spacing copperThickness1oz (default): track to track 0.102, other pairs 0.152 to 0.3
spacing copperThickness2oz: track to track 0.203, other pairs 0.152 to 0.3
track width copperThickness1oz (default): min 0.127, default 0.254, max 2.54
track width copperThickness2oz: min 0.203, default 0.254, max 2.54
track width power: min 0.254, default 0.45, max 2.54
differential pair differentialPair (default): width min 0.127, default 0.254, max 2.54; gap min 0.152, default 0.152
net 12V uses copperThickness2oz, power
net GND uses copperThickness2oz, power
net 5V uses copperThickness2oz, power
net VBAT uses copperThickness2oz
net AO1 uses power
net AO2 uses power
net BO1 uses power
net BO2 uses power

## Placement (name value [footprint] x y rotation side)
C1  22uF  [C0603]  25.06 70.89 0 top
C2  100nF  [C0603]  28.59 70.89 0 top
C3  10nF  [C0603]  45.34 79.03 0 top
C4  22uF  [C0603]  32.79 70.18 0 top
C5  22uF  [C0603]  36.32 70.18 0 top
C6  100nF  [C0603]  39.86 70.18 0 top
C7  22uF  [C0603]  61.21 60.36 0 top
C8  22uF  [C0603]  3.56 66.84 0 top
C9  100nF  [C0603]  64.74 60.36 0 top
C10  100nF  [C0603]  65.91 57.31 0 top
C11  22uF  [C0603]  61.25 53.84 0 top
C12  22uF  [C0603]  64.92 53.84 0 top
C13  100nF  [C0603]  68.45 53.84 0 top
D1  SS510  [SMA_L4.3-W2.6-LS5.0-RD]  19.43 76.36 0 top
D2  SMAJ28A  [SMA_L4.4-W2.8-LS5.4-RD]  19.45 70.89 0 top
D3  B340A  [SMA_L4.3-W2.6-LS5.0-RD]  47.62 75.35 0 top
DC1  DC-044A-20A  [DC-IN-TH_DC-044A-20A]  7.72 78.75 0 top
K1  SRD-03VDC-SL-C  [RELAY-TH_SRD-XXVDC-XL-C]  10.16 24.04 0 top
K2  SRD-03VDC-SL-C  [RELAY-TH_SRD-XXVDC-XL-C]  32.83 24.04 0 top
K3  SRD-03VDC-SL-C  [RELAY-TH_SRD-XXVDC-XL-C]  55.5 24.04 0 top
L1  15uH  [IND-SMD_L7.5-W6.6]  37.97 76.24 0 top
L2  GZ2012D101TF  [L0805]  3.94 70.01 0 top
L3  2.2uH  [IND-SMD_L4.6-W4.1_MHCI04015]  75.56 59.6 0 top
P1  WJ124-3.81-04P-14-00A  [CONN-TH_4P-P3.81_KF124-3.81-4P]  95.63 75.86 0 top
R1  10kΩ  [R0603]  44.6 72.05 0 top
R2  3.24kΩ  [R0603]  48.77 71.79 0 top
R7  10kΩ  [R0603]  61.34 57.06 0 top
R8  100kΩ  [R0603]  71.93 53.84 0 top
R9  22kΩ  [R0603]  75.69 55.03 0 top
SW1  TS-1101-C-W  [SW-SMD_L6.0-W3.3-LS8.0]  78.49 19.47 0 top
SW2  TS-1101-C-W  [SW-SMD_L6.0-W3.3-LS8.0]  91.06 19.34 0 top
SW3  TS-1101-C-W  [SW-SMD_L6.0-W3.3-LS8.0]  78.41 10.81 0 top
SW4  TS-1101-C-W  [SW-SMD_L6.0-W3.3-LS8.0]  90.93 10.83 0 top
U1  TPS5430DDAR  [ESOP-8_L4.9-W3.9-P1.27-LS6.0-TL-EP]  28.65 77.38 90 top
U2  MT3520B  [SOT-23-5_L3.0-W1.7-P0.95-LS2.8-BR]  69.85 59.09 0 top
U3  TB6612FNG(O,C,8,EL  [SSOP-24_L8.4-W5.8-P0.65-LS7.8-BL]  81.15 76.49 90 top
U4  DHT11  [SENSOR-TH_DHT11]  95.12 52.23 90 top
U5  2.4GHz  [WIFIM-TH_8P-L24.7-W14.4-P2.54]  64.52 69.89 90 top
U6  LCKFB-DKX-STM32F103C8T6  [CONN-TH_L53.3-W22.9_STM32F103C8T6-CARD]  28.7 48.93 0 top
U7  KH-2.54FH-1X20P-H8.5  [HDR-TH_20P-P2.54-V-F-2]  28.57 34.96 0 top
U8  KH-2.54FH-1X20P-H8.5  [HDR-TH_20P-P2.54-V-F-2]  28.57 63.16 0 top
USB2  USB-231-ARY  [USB-A-TH_USB-231-ARY]  10.92 11.21 0 top
USB3  USB-231-ARY  [USB-A-TH_USB-231-ARY]  36.32 11.34 0 top
USB4  USB-231-ARY  [USB-A-TH_USB-231-ARY]  60.96 11.59 0 top

## Footprints (pads in the part's own frame, mm; a bottom-side part is the same pattern mirrored in y, then rotated)
C0603
  rect 0.8x0.9 smd: 1(-0.7,0) 2(0.7,0)
CONN-TH_4P-P3.81_KF124-3.81-4P
  round 1.778 hole 1.143: 1(0,5.715) 2(0,1.905) 3(0,-1.905) 4(0,-5.715)
CONN-TH_L53.3-W22.9_STM32F103C8T6-CARD
  round 1.6 hole 1: 1(-24.13,-7.62) 2(-21.59,-7.62) 3(-19.05,-7.62) 4(-16.51,-7.62) 5(-13.97,-7.62) 6(-11.43,-7.62) 7(-8.89,-7.62) 8(-6.35,-7.62) 9(-3.81,-7.62) 10(-1.27,-7.62) 11(1.27,-7.62) 12(3.81,-7.62) 13(6.35,-7.62) 14(8.89,-7.62) 15(11.43,-7.62) 16(13.97,-7.62) 17(16.51,-7.62) 18(19.05,-7.62) 19(21.59,-7.62) 20(24.13,-7.62) 21(24.13,7.62) 22(21.59,7.62) 23(19.05,7.62) 24(16.51,7.62) 25(13.97,7.62) 26(11.43,7.62) 27(8.89,7.62) 28(6.35,7.62) 29(3.81,7.62) 30(1.27,7.62) 31(-1.27,7.62) 32(-3.81,7.62) 33(-6.35,7.62) 34(-8.89,7.62) 35(-11.43,7.62) 36(-13.97,7.62) 37(-16.51,7.62) 38(-19.05,7.62) 39(-21.59,7.62) 40(-24.13,7.62)
DC-IN-TH_DC-044A-20A
  oval 3x1.6 hole 2.2x1: 1(3.625,-4.5) 2(3.625,4.001) 3(3.625,-1.3) 4(-3.625,-4.9) 5(-3.625,4.9)
ESOP-8_L4.9-W3.9-P1.27-LS6.0-TL-EP
  rect 1.3x0.6 smd: 1(-2.7,1.905) 2(-2.7,0.635) 3(-2.7,-0.635) 4(-2.7,-1.905) 5(2.7,-1.905) 6(2.7,-0.635) 7(2.7,0.635) 8(2.7,1.905)
  rect 2.5x3.5 smd: 9(0,0)
HDR-TH_20P-P2.54-V-F-2
  rect 1.65x1.65 hole 1.02: 1(-24.13,0)
  round 1.65 hole 1.02: 2(-21.59,0) 3(-19.05,0) 4(-16.51,0) 5(-13.97,0) 6(-11.43,0) 7(-8.89,0) 8(-6.35,0) 9(-3.81,0) 10(-1.27,0) 11(1.27,0) 12(3.81,0) 13(6.35,0) 14(8.89,0) 15(11.43,0) 16(13.97,0) 17(16.51,0) 18(19.05,0) 19(21.59,0) 20(24.13,0)
IND-SMD_L4.6-W4.1_MHCI04015
  rect 1.5x2.5 smd: 1(-1.85,0) 2(1.85,0)
IND-SMD_L7.5-W6.6
  rect 3x3.5 smd: 1(-3.302,0) 2(3.302,0)
L0805
  rect 1.133x1.377 smd: 1(-0.966,0) 2(0.966,0)
R0603
  rect 0.806x0.864 smd: 1(-0.753,0) 2(0.753,0)
RELAY-TH_SRD-XXVDC-XL-C
  round 2.794 hole 1.524: 1(-5.1,-6) 2(7.1,-6) 3(7.1,6) 4(-5.1,6) 5(-7.1,0)
SENSOR-TH_DHT11
  rect 1.296x1.296 hole 0.711: 1(-3.81,0)
  round 1.296 hole 0.711: 2(-1.27,0) 3(1.27,0) 4(3.81,0)
SMA_L4.3-W2.6-LS5.0-RD
  rect 2.046x1.62 smd: 1(-2.404,-0.009) 2(2.404,0.009)
SMA_L4.4-W2.8-LS5.4-RD
  rect 2.046x1.62 smd: 1(-2.566,0) 2(2.566,0)
SOT-23-5_L3.0-W1.7-P0.95-LS2.8-BR
  rect 1.1x0.6 smd: 1(1.3,-0.95) 2(1.3,0) 3(1.3,0.95) 4(-1.3,0.95) 5(-1.3,-0.95)
SSOP-24_L8.4-W5.8-P0.65-LS7.8-BL
  oval 0.364x2.082 smd: 1(-3.575,-3.491) 2(-2.925,-3.491) 3(-2.275,-3.491) 4(-1.625,-3.491) 5(-0.975,-3.491) 6(-0.325,-3.491) 7(0.325,-3.491) 8(0.975,-3.491) 9(1.625,-3.491) 10(2.275,-3.491) 11(2.925,-3.491) 12(3.575,-3.491) 13(3.575,3.491) 14(2.925,3.491) 15(2.275,3.491) 16(1.625,3.491) 17(0.975,3.491) 18(0.325,3.491) 19(-0.325,3.491) 20(-0.975,3.491) 21(-1.625,3.491) 22(-2.275,3.491) 23(-2.925,3.491) 24(-3.575,3.491)
SW-SMD_L6.0-W3.3-LS8.0
  rect 1.9x1.5 smd: 1(-3.8,0) 2(3.8,0)
USB-A-TH_USB-231-ARY
  round 1.6 hole 1: 1(-3.5,1.355) 2(-1,1.355) 3(1,1.355) 4(3.5,1.355)
  round 3.3 hole 2.5: 5(-6.57,-1.355) 6(6.57,-1.355)
WIFIM-TH_8P-L24.7-W14.4-P2.54
  rect 1.8x1.8 hole 1: 1(1.27,3.81)
  round 1.8 hole 1: 2(1.27,1.27) 3(1.27,-1.27) 4(1.27,-3.81) 5(-1.27,3.81) 6(-1.27,1.27) 7(-1.27,-1.27) 8(-1.27,-3.81)

## Nets
As in the schematic.

Pads without a net: K1 3; K2 3; K3 3; U1 2 3 5; U4 3; U5 2 3; USB2 2 3; USB3 2 3; USB4 2 3

## Via types
v1: diameter 0.61, hole 0.305, Top Layer to Bottom Layer, 23 vias

## Routing (per net, layer and track width the routed paths; a pad name or vN(x,y) marks a point on that pad's centre or on a via; arc(x,y) is an arc through that point)
3V3: length 218.2
  Top Layer w0.254: 77.16,54.41 76.65,53.91 72.59,53.91 R8.2 72.43,53.84 71.67,53.08 70.65,53.08 69.89,53.84 C13.2 ; 77.16,54.41 77.16,55.94 77.41,56.19 L3.2 77.41,60.72 v1(73.1,65.04) ; 77.16,54.41 83,48.57 94.94,48.57 95.09,48.42 ; 89.4,10.83 SW4.2 94.86,10.96 SW2.2 94.86,48.2 95.09,48.42 ; 89.4,10.83 88.36,9.8 85.82,9.8 84.81,10.81 SW3.2 ; 89.4,10.83 82.29,17.94 SW1.2 ; 63.56,53.08 53.15,42.66 53.15,42.15 52.89,41.9 52.89,41.39 U6.20 ; 63.56,53.08 62.8,53.84 61.96,53.84 ; 63.56,53.08 64.07,53.08 64.83,52.31 67.63,52.31 C13.2 ; C13.2 68.39,54.6 67.12,54.6 66.36,53.84 C12.2 ; 95.09,48.42 U4.1
  Bottom Layer w0.254: U7.20 52.71,35.09 52.83,35.22 U6.20 51.56,42.58 47.24,42.58 46.48,41.82 46.48,34.71 45.47,33.69 37.08,33.69 36.32,34.45 36.32,41.82 22.86,55.28 11.68,55.28 10.41,56.55 U6.38 9.65,62.9 9.53,63.03 U8.3 ; v1(73.1,65.04) 69.54,68.6 68.53,68.6 U5.8
5V: length 179.4
  Top Layer w0.328: U3.20 78.97,75.52 79.32,75.17 ; U2.4 69.26,60.04 72.41,63.19 72.41,67.24 77.66,72.49 U3.24 78.87,72.92 79.32,73.37 79.32,75.17 ; 79.32,75.17 79.32,79.11 79.01,79.42 U3.14 U3.13
  Top Layer w0.45: 63.28,59.46 62.38,60.36 61.91,60.36 ; 63.28,59.46 61.94,58.11 61.49,58.11 60.59,57.21 R7.1 47.75,44.22 U6.18 ; 63.28,59.46 64.63,59.46 65.53,60.36 ; C4.2 33.87,70.18 34.77,71.08 36.12,71.08 C5.2 37.98,71.15 40.62,71.15 ; 65.53,60.36 65.85,60.04 U2.4 ; 65.53,60.36 C9.2 ; 41.52,72.95 41.52,75.99 L1.2 ; 41.52,72.95 40.62,72.05 40.62,70.25 C6.2 ; 41.52,72.95 44.46,72.95 R1.2 45.36,72.76 47.06,74.47 47.06,74.92 51.56,79.42 U3.14 ; K3.5 K2.5 K1.5
  Bottom Layer w0.45: 47.75,35.01 U7.18 ; 47.75,35.01 48.2,34.56 48.2,24.21 K3.5 ; 47.75,35.01 U6.18
12V: length 23.1
  Top Layer w0.45: C8.2 4.26,67.53 10.97,74.24 DC1.1 12.29,74.24 15.77,77.72 18.47,77.72 19.82,76.37 D1.2
GND: length 392.4
  Top Layer w0.328: v1(80.26,78.12) U3.9 U3.10 ; 82.97,78.12 82.97,75.42 83.41,74.97 84.54,74.97 U3.4 U3.3 ; v1(76.26,76.82) U3.18
  Top Layer w0.45: U1.6 29.1,79.89 29.1,77.83 U1.9 28.2,77.33 27.75,77.33 25.95,75.53 25.95,73.73 26.4,73.28 28.65,73.28 30.14,71.79 30.14,69.99 ; v1(70.16,59.01) 71.06,59.01 U2.2 71.93,59.09 72.38,58.64 72.38,57.74 74.94,55.18 R9.1 ; U4.4 95.12,56.52 95.12,60.57 82.97,72.72 82.97,73.62 83.41,74.07 83.41,74.97 ; 48.01,71.39 48.46,71.39 48.91,70.94 50.26,70.94 50.71,71.39 ; 48.01,71.39 R2.1 ; 48.01,71.39 46.81,70.18 42.31,70.18 41.41,69.28 40.06,69.28 C6.1 38.77,69.73 38.32,69.28 36.52,69.28 C5.1 35.24,70.18 34.34,69.28 32.99,69.28 C4.1 31.94,69.99 28.79,69.99 C2.1 27.51,70.89 26.61,69.99 25.26,69.99 C1.1 D2.2 21.92,70.89 20.48,69.46 13.28,69.46 U8.2 ; C7.1 60.51,60.61 60.71,60.81 60.71,62.16 59.36,63.51 59.36,69.36 60.71,70.71 U5.1 ; D3.2 50.03,75.23 50.71,74.54 50.71,71.39 ; 50.71,71.39 51.16,71.39 51.4,71.16 v1(52.75,71.16) ; U8.1 4.44,65.25 C8.1 2.86,67.97 4.9,70.01 5.12,70.25 5.12,72.5 10.07,77.45 DC1.3 ; DC1.2 9.62,82.75 8.72,83.65 DC1.5 ; U6.19 50.29,43.58 C11.1 61.58,54.86 62.87,54.86 63.77,53.96 64.22,53.96 ; 64.22,53.96 C12.1 65.12,52.94 66.47,52.94 67.37,53.84 C13.1 ; 64.22,53.96 64.42,54.16 v1(64.42,57.31) 65.21,57.31 ; 60.71,61.26 v1(62.96,61.26) 63.86,60.36 64.04,60.36
  Bottom Layer w0.328: U5.1 66.11,76.56 76.01,76.56 v1(76.26,76.82) 77.56,78.12 v1(80.26,78.12)
  Bottom Layer w0.45: 6.98,56.68 U8.2 U8.1 ; 6.98,56.68 4.73,56.68 U6.40 ; 6.98,56.68 U6.39 ; 64.31,59.01 v1(70.16,59.01) ; 54.39,12.55 56.19,12.55 57.09,11.65 62.49,11.65 63.39,12.55 63.84,12.55 64.29,13 USB4.4 67.16,10.25 USB4.6 ; K2.4 27.73,20.56 25.93,18.76 25.93,16.96 27.95,14.94 27.95,9.99 ; DC1.2 DC1.3 ; USB2.5 4.52,9.87 11.72,9.87 USB2.4 14.43,12.56 14.79,12.56 USB2.6 17.6,9.99 USB3.5 29.92,10 37.12,10 USB3.4 40.19,12.69 USB3.6 43.14,10.24 USB4.5 54.39,26.05 K3.4 50.31,30.04 50.29,30.06 50.29,35.01 ; 4.97,9.87 4.97,15.27 3.17,17.07 3.17,18.87 4.97,20.67 4.97,29.95 K1.4 ; v1(64.42,57.31) 64.42,58.11 64.31,58.11 64.31,59.91 v1(62.96,61.26) ; 50.29,35.01 U7.19 ; 50.29,35.01 U6.19 ; v1(52.75,71.16) U5.1
VBAT: length 6.7
  Bottom Layer w0.254: U8.20 52.71,63.03 52.83,62.9 U6.21
VBUS1: length 12.1
  Bottom Layer w0.254: K1.2 12.94,13.72 8.62,13.72 7.47,12.57 USB2.1
VBUS2: length 9.3
  Bottom Layer w0.254: K2.2 35.87,13.98 34.85,13.98 33.58,12.71 33.07,12.71 USB3.1
VBUS3: length 7.2
  Bottom Layer w0.254: USB4.1 57.52,12.96 K3.2
AO1: length 19.4
  Top Layer w0.328: P1.1 95.63,79.87 96.98,78.52 96.98,77.17 93.38,73.57 U3.2 U3.1
AO2: length 12.3
  Top Layer w0.328: P1.2 95.54,77.76 93.95,76.17 U3.6 U3.5
BO1: length 15.5
  Top Layer w0.328: v1(88.16,77.62) 87.65,77.62 85.85,79.42 U3.11 U3.12
  Bottom Layer w0.328: v1(88.16,77.62) P1.4
BO2: length 12.8
  Top Layer w0.328: v1(92.77,76.82) U3.7 U3.8
  Bottom Layer w0.328: v1(92.77,76.82) P1.3
PA0: length 57
  Top Layer w0.254: SW1.1 64.53,29.63 64.53,30.64 54.11,41.06 v1(54.11,42.58) ; U6.25 42.68,56.3 42.68,55.03 v1(48.78,48.93)
  Bottom Layer w0.254: U8.16 42.54,63.03 42.67,62.9 U6.25 ; v1(54.11,42.58) 48.78,47.92 v1(48.78,48.93)
PA1: length 70.6
  Top Layer w0.254: SW2.1 59.57,47.03 v1(58.56,47.03) ; U6.26 40.27,56.68 41.03,56.68 42.05,57.7 43.06,57.7 43.82,56.93 43.82,56.17 44.59,55.41 49.16,55.41 v1(52.21,52.36)
  Bottom Layer w0.254: U8.15 40,63.03 40.13,62.9 U6.26 ; v1(58.56,47.03) 53.22,52.36 v1(52.21,52.36)
PA2: length 75.2
  Top Layer w0.254: SW3.1 51.5,33.93 51.5,35.2 46.67,40.02 44.89,40.02 43.88,41.04 43.88,43.58 33.97,53.49 33.97,57.04 34.73,57.8 35.49,57.8 36.76,56.53 37.53,56.53 U6.27
  Bottom Layer w0.254: U8.14 37.47,63.03 37.59,62.9 U6.27
PA3: length 80.2
  Top Layer w0.254: U6.28 35.06,56.3 35.06,53 46.49,41.57 46.49,40.8 47.25,40.04 50.05,40.04 71.89,18.2 79.77,18.2 SW4.1
  Bottom Layer w0.254: U6.28 35.05,62.9 34.93,63.03 U8.13
PA4: length 56.8
  Top Layer w0.254: U3.21 62.17,74.87 52.01,64.71 34.74,64.71 33.21,63.18 32.7,63.18 U8.12
  Bottom Layer w0.254: U8.12 32.38,56.81 32.51,56.68 U6.29
PA5: length 61.4
  Top Layer w0.254: U8.11 30.01,63.04 30.77,63.04 31.79,62.02 35.35,62.02 35.6,62.28 35.85,62.28 35.85,62.53 36.11,62.79 36.11,63.55 36.87,64.31 53.13,64.31 v1(54.14,63.29) ; v1(62.78,66.6) 68.62,66.6 76.24,74.22 U3.22
  Bottom Layer w0.254: v1(62.78,66.6) 59.48,63.29 v1(54.14,63.29) ; U6.30 29.97,56.68 29.84,56.81 U8.11
PA6: length 78.1
  Top Layer w0.254: U6.31 28.32,56.55 30.1,58.33 52.71,58.33 54.48,56.55 v1(55.75,56.55)
  Bottom Layer w0.254: U4.2 89.53,56.55 v1(55.75,56.55) ; U8.10 27.31,63.03 27.43,62.9 U6.31
PA7: length 64.9
  Top Layer w0.254: U3.19 62.93,76.17 52.01,65.24 27.62,65.24 25.59,63.21 24.83,63.21 U8.9
  Bottom Layer w0.254: U8.9 24.77,56.81 24.89,56.68 U6.32
PA8: length 6.4
  Bottom Layer w0.254: U6.5 14.73,35.22 14.61,35.09 U7.5
PA9: length 6.4
  Bottom Layer w0.254: U6.6 17.27,35.22 17.14,35.09 U7.6
PA10: length 6.4
  Bottom Layer w0.254: U6.7 19.81,35.22 19.69,35.09 U7.7
PA11: length 6.4
  Bottom Layer w0.254: U7.8 22.22,35.09 22.35,35.22 U6.8
PA12: length 6.4
  Bottom Layer w0.254: U7.9 24.77,35.09 24.89,35.22 U6.9
PA15: length 6.4
  Bottom Layer w0.254: U6.10 27.43,35.22 27.31,35.09 U7.10
PB0: length 69
  Top Layer w0.254: U6.33 22.39,56.8 22.39,59.85 24.42,61.88 ; 24.42,61.88 24.93,61.88 25.19,62.14 26.71,62.14 27.22,61.63 55.67,61.63 v1(57.95,63.91) ; 24.42,61.88 23.15,63.15 22.39,63.15 U8.8 ; U3.23 76.49,73.57 66.08,63.15 61.76,63.15 60.24,64.68 v1(60.24,64.93)
  Bottom Layer w0.254: v1(60.24,64.93) 59.22,63.91 v1(57.95,63.91)
PB1: length 71.1
  Top Layer w0.254: U8.7 19.85,63.27 20.11,63.27 22.9,66.07 48.81,66.07 61.51,78.77 U3.15
  Bottom Layer w0.254: U8.7 19.69,56.81 19.81,56.68 U6.34
PB3: length 38.2
  Bottom Layer w0.254: K1.1 15.22,28.2 22.84,28.2 29.6,34.96 U7.11 29.84,41.06 29.97,41.19 U6.11
PB4: length 25.2
  Bottom Layer w0.254: K2.1 32.3,22.61 32.3,34.8 U7.12 32.38,41.06 32.51,41.19 U6.12
PB5: length 30.3
  Bottom Layer w0.254: K3.1 40.24,28.2 39.22,28.2 35.16,32.26 35.16,34.55 34.91,34.8 U7.13 34.93,41.06 35.05,41.19 U6.13
PB6: length 6.4
  Bottom Layer w0.254: U6.14 37.59,35.22 37.47,35.09 U7.14
PB7: length 6.4
  Bottom Layer w0.254: U7.15 40,35.09 40.13,35.22 U6.15
PB8: length 43.3
  Bottom Layer w0.254: U5.7 54.1,56.93 54.1,55.66 42.67,44.23 U6.16 42.67,35.22 42.54,35.09 U7.16
PB9: length 41.2
  Top Layer w0.254: v1(61.98,63.79) 61.98,67.35 U5.6
  Bottom Layer w0.254: v1(61.98,63.79) 54.61,56.43 54.61,55.66 45.21,46.27 U6.17 45.21,35.22 45.09,35.09 U7.17
PB10: length 61.4
  Top Layer w0.254: v1(19.81,65.82) U8.6
  Bottom Layer w0.254: U5.4 67.06,69.89 53.59,69.89 49.28,65.57 20.07,65.57 v1(19.81,65.82) ; U8.6 17.14,56.81 17.27,56.68 U6.35
PB11: length 55
  Bottom Layer w0.254: 14.73,63.16 U6.36 ; U8.5 15.49,63.16 16.76,64.43 56.51,64.43 U5.5
PB12: length 6.4
  Bottom Layer w0.254: U6.1 4.57,35.22 4.44,35.09 U7.1
PB13: length 104.3
  Top Layer w0.254: v1(50.59,66.04) 51.35,66.04 62.78,77.47 U3.17
  Bottom Layer w0.254: v1(50.59,66.04) 49.57,65.02 9.74,65.02 8.21,63.5 8.21,42.41 U6.2 7.11,35.22 6.98,35.09 U7.2
PB14: length 96
  Top Layer w0.254: U3.16 61.76,78.12 49.32,65.67 23.15,65.67 20.87,63.38 20.87,62.62 16.04,57.8 16.04,56.27 9.69,49.92 9.69,41.54 U6.3
  Bottom Layer w0.254: U7.3 9.53,35.09 9.65,35.22 U6.3
PB15: length 6.4
  Bottom Layer w0.254: U6.4 12.19,35.22 12.06,35.09 U7.4
PC13: length 6.7
  Bottom Layer w0.254: U6.22 50.29,62.9 50.16,63.03 U8.19
PC14: length 6.7
  Bottom Layer w0.254: U6.23 47.75,62.9 47.62,63.03 U8.18
PC15: length 6.7
  Bottom Layer w0.254: U6.24 45.21,62.9 45.09,63.03 U8.17
RESET: length 6.7
  Bottom Layer w0.254: U6.37 12.19,62.9 12.06,63.03 U8.4
$1N32: length 5.7
  Top Layer w0.254: DC1.4 2.46,73.85 2.97,73.34 L2.1
$1N65: length 10.9
  Top Layer w0.254: R7.2 63.31,57.06 64.33,58.08 65.85,58.08 C10.2 66.66,57.36 66.66,57.62 67.93,58.89 69.22,58.89 69.97,58.14 U2.1
$1N68: length 2.7
  Top Layer w0.254: U2.3 73.27,60.04 L3.1
$1N73: length 11.7
  Top Layer w0.254: R9.2 76.41,55.03 75.64,54.27 74.37,54.27 73.54,55.09 71,55.09 ; R8.1 71,54.08 71,56.11 68.97,58.14 U2.5
$1N77: length 29.3
  Top Layer w0.254: C1.2 25.99,71.17 26.75,71.93 ; C2.2 28.5,71.68 27,71.68 25.22,73.46 25.22,75.74 ; U1.7 28.02,79.3 27.76,79.05 26.75,79.05 26.49,78.79 26.49,77.01 25.22,75.74 ; D2.1 17.03,71.02 D1.1 17.25,76.35 18.37,75.24 22.94,75.24 23.45,75.74 25.22,75.74
$1N81: length 29.5
  Top Layer w0.254: D3.1 45.22,76.75 46.75,78.27 46.75,79.79 45.47,79.79 45.22,79.54 45.15,79.54 C3.1 44.53,79.06 39.7,79.06 39.45,78.81 36.15,78.81 34.62,77.28 ; U1.8 27,80.33 27,80.58 27.51,81.09 31.07,81.09 33.1,79.06 33.1,78.81 34.62,77.28 ; L1.1 34.62,76.27 34.62,77.28
$1N82: length 23.6
  Top Layer w0.254: C3.2 45.8,78.76 45.29,78.25 44.02,78.25 43.77,78.5 39.7,78.5 39.45,78.25 39.45,77.23 36.4,74.18 32.84,74.18 31.32,75.71 27,75.71 26.75,75.45 U1.1
$1N88: length 21.7
  Top Layer w0.254: U1.4 30.56,73.9 32.34,72.12 39.7,72.12 v1(39.78,72.05) ; v1(41.81,72.05) R1.1 44.61,71.28 46.14,71.28 47.41,72.55 48.76,72.55 R2.2
  Bottom Layer w0.254: v1(39.78,72.05) v1(41.81,72.05)

## Text on the board
Bottom Silkscreen Layer: 2024313207曹铮
Top Silkscreen Layer: 12V -> 5V | USB-A Power | DCDC 5V -> 3V3 | Motor Driver&Output | DHT11 | USB Device | ESP-01S 2.4GHz | SWD Debug | ▶
